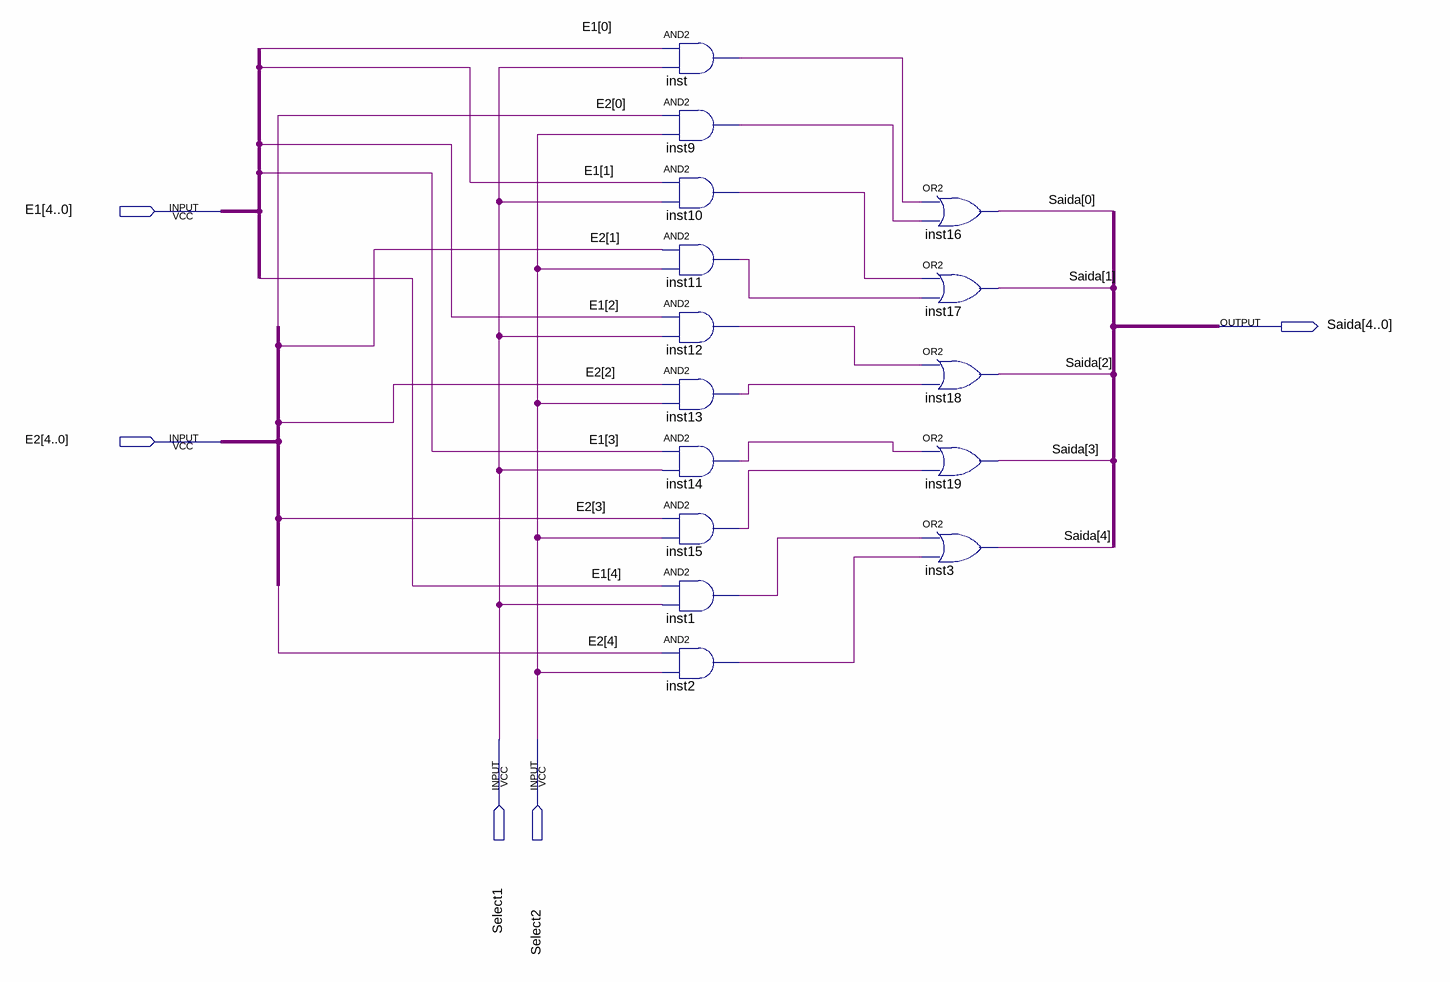
[diagram p0: schematic sheet]
// Quartus schematic MUX_2S_2E_5bits.bdf as structural Verilog: 15 symbols, 5 pins
module MUX_2S_2E_5bits (
  input  [4:0] E1,
  input  [4:0] E2,
  input  Select1,
  input  Select2,
  output [4:0] Saida
);

  wire inst1_out, inst2_out, inst9_out, inst10_out, inst11_out, inst12_out, inst13_out, inst14_out,
       inst15_out, inst_out;

  and inst (inst_out, E1[0], Select1);
  and inst9 (inst9_out, E2[0], Select2);
  and inst10 (inst10_out, E1[1], Select1);
  and inst11 (inst11_out, E2[1], Select2);
  and inst12 (inst12_out, E1[2], Select1);
  and inst13 (inst13_out, E2[2], Select2);
  and inst14 (inst14_out, E1[3], Select1);
  and inst15 (inst15_out, E2[3], Select2);
  and inst1 (inst1_out, E1[4], Select1);
  and inst2 (inst2_out, E2[4], Select2);
  or inst16 (Saida[0], inst_out, inst9_out);
  or inst17 (Saida[1], inst10_out, inst11_out);
  or inst18 (Saida[2], inst12_out, inst13_out);
  or inst19 (Saida[3], inst14_out, inst15_out);
  or inst3 (Saida[4], inst1_out, inst2_out);
endmodule
